# Altium project Dionysus.PrjPcb (part 2 of 2)

## Sheet FPGA Expansion.SchDoc: FPGA Expansion
size B; CompanyName: Cospan Design; DrawnBy: David McCoy; Engineer: David McCoy; DocumentNumber: 6; SheetNumber: 6; SheetTotal: 8
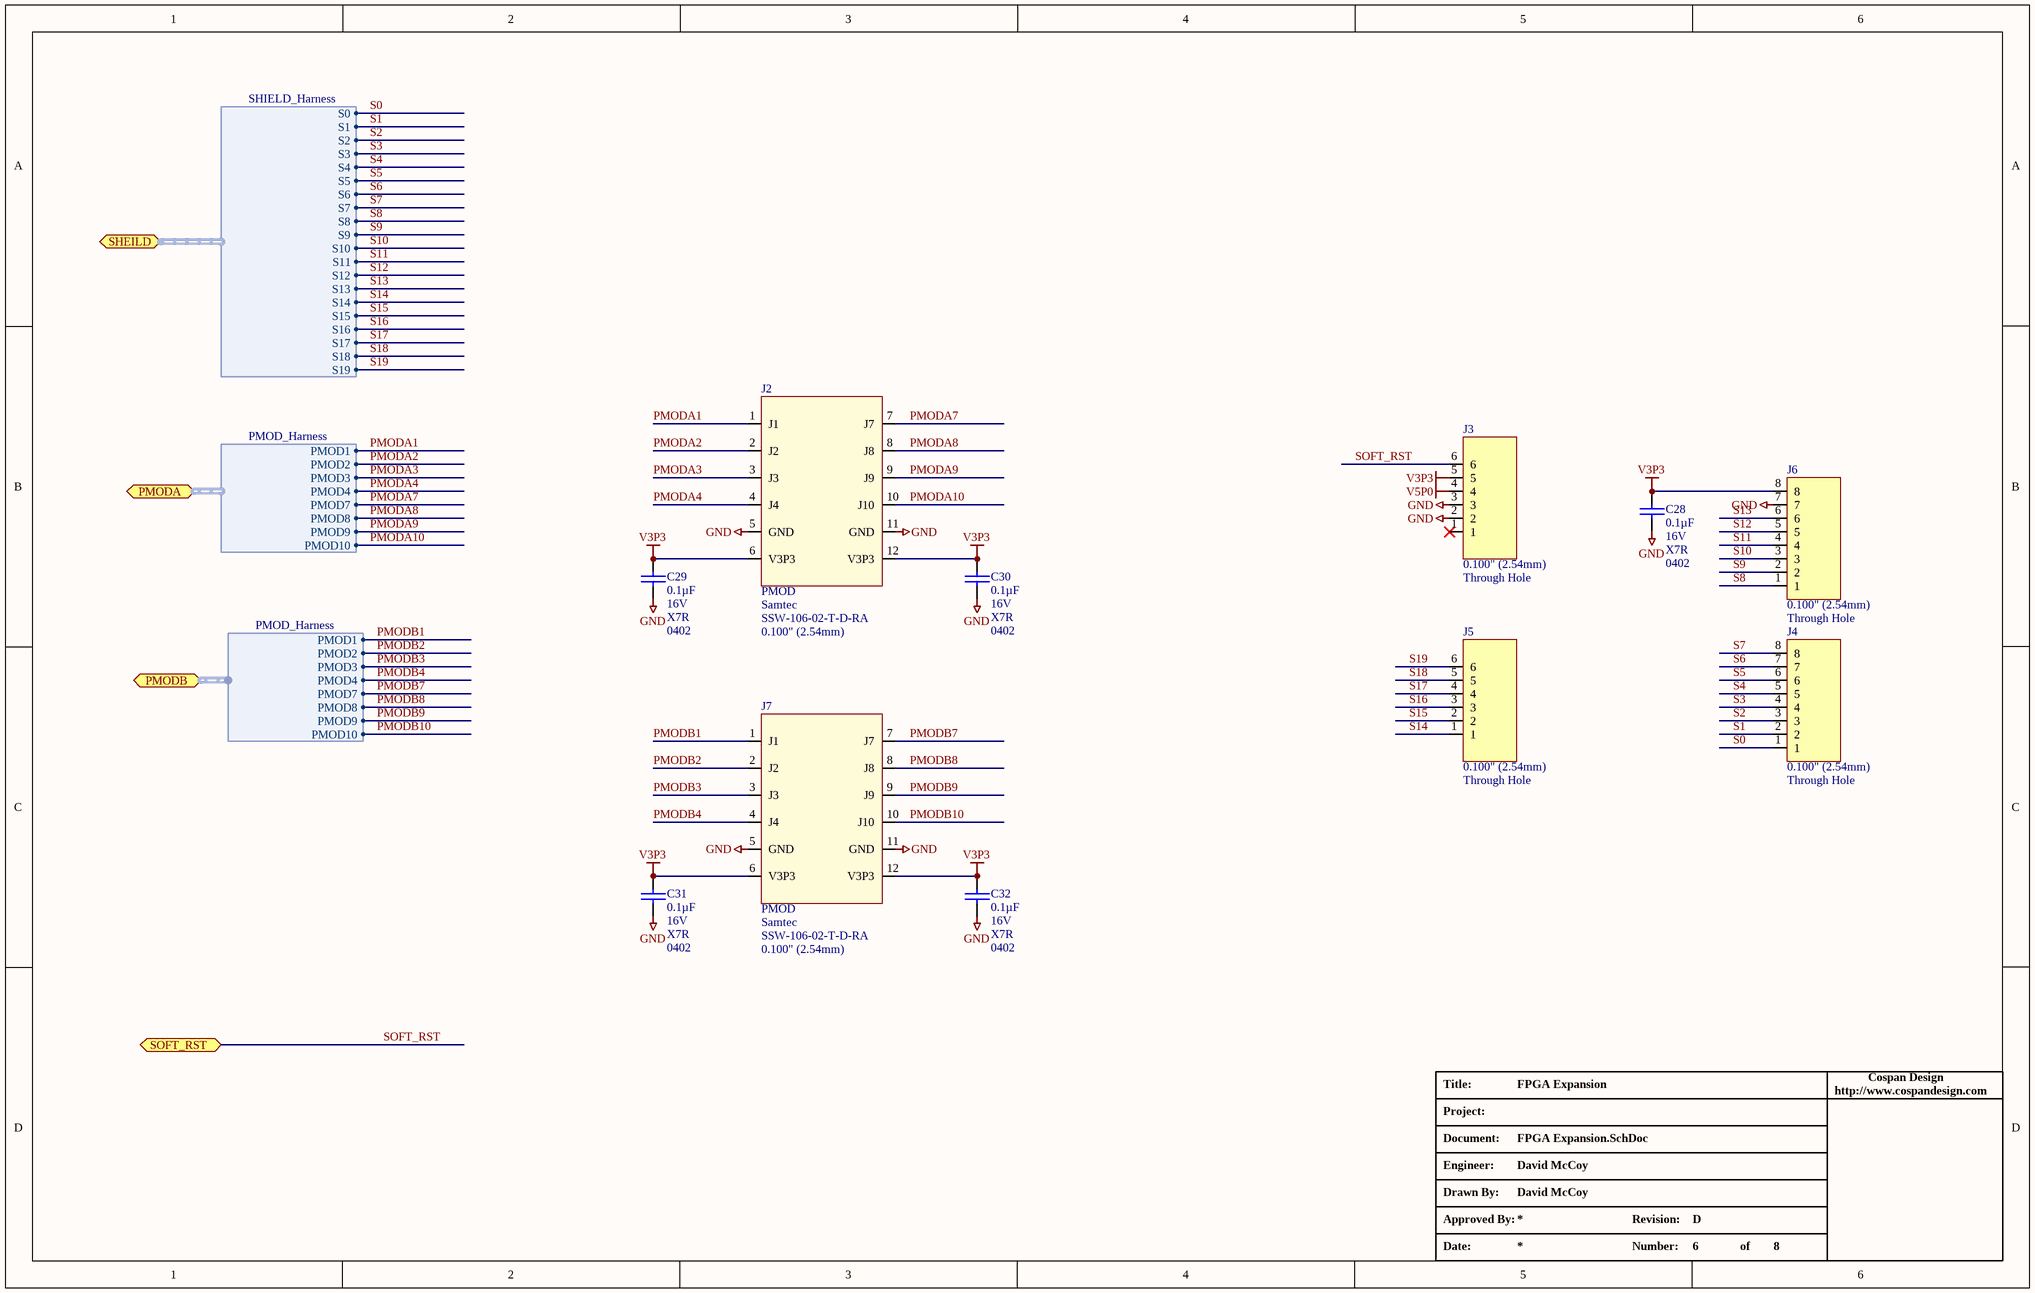
[diagram p4: FPGA Expansion.SchDoc]

### Parts
C28  Capacitance: 0.1µF  Voltage - Rated: 16V  Temperature Coefficient: X7R  Package / Case: 0402  [C_ERA-0402]  (hidden comment: 0.1uF)
C29  Capacitance: 0.1µF  Voltage - Rated: 16V  Temperature Coefficient: X7R  Package / Case: 0402  [C_ERA-0402]  (hidden comment: 0.1uF)
C30  Capacitance: 0.1µF  Voltage - Rated: 16V  Temperature Coefficient: X7R  Package / Case: 0402  [C_ERA-0402]  (hidden comment: 0.1uF)
C31  Capacitance: 0.1µF  Voltage - Rated: 16V  Temperature Coefficient: X7R  Package / Case: 0402  [C_ERA-0402]  (hidden comment: 0.1uF)
C32  Capacitance: 0.1µF  Voltage - Rated: 16V  Temperature Coefficient: X7R  Package / Case: 0402  [C_ERA-0402]  (hidden comment: 0.1uF)
J2  PMOD  Manufacturer: Samtec  Manufacturer Part Number: SSW-106-02-T-D-RA  Pitch: 0.100" (2.54mm)  [PMOD]
J3  Pitch: 0.100" (2.54mm)  Mounting Type: Through Hole  [HDR_1X6 - FEMALE]  (hidden comment: J_HDR1X6_THRHOLE_VERT_FEMALE)
J4  Pitch: 0.100" (2.54mm)  Mounting Type: Through Hole  [HDR_1X8 - FEMALE]  (hidden comment: J_HDR1X8_THRHOLE_VERT_RECPT)
J5  Pitch: 0.100" (2.54mm)  Mounting Type: Through Hole  [HDR_1X6 - FEMALE]  (hidden comment: J_HDR1X6_THRHOLE_VERT_FEMALE)
J6  Pitch: 0.100" (2.54mm)  Mounting Type: Through Hole  [HDR_1X8 - FEMALE]  (hidden comment: J_HDR1X8_THRHOLE_VERT_RECPT)
J7  PMOD  Manufacturer: Samtec  Manufacturer Part Number: SSW-106-02-T-D-RA  Pitch: 0.100" (2.54mm)  [PMOD]

### Ports
PMODA (harness PMOD_Harness), PMODB (harness PMOD_Harness), SHEILD (harness SHIELD_Harness), SOFT_RST

### Harnesses
SHIELD_Harness: S0, S1, S2, S3, S4, S5, S6, S7, S8, S9, S10, S11, S12, S13, S14, S15, S16, S17, S18, S19
PMOD_Harness: PMOD1, PMOD2, PMOD3, PMOD4, PMOD7, PMOD8, PMOD9, PMOD10

### Nets
GND: C28.1 C29.1 C30.1 C31.1 C32.1 J2.5(GND) J2.11(GND) J3.2 J3.3 J6.7 J7.5(GND) J7.11(GND)
V3P3: C28.2 C29.2 C30.2 C31.2 C32.2 J2.6(V3P3) J2.12(V3P3) J3.5 J6.8 J7.6(V3P3) J7.12(V3P3)  [project net ~{CS}]
V5P0: J3.4
PMODA1: J2.1(J1) ; port PMODA.PMOD1
PMODA2: J2.2(J2) ; port PMODA.PMOD2
PMODA3: J2.3(J3) ; port PMODA.PMOD3
PMODA4: J2.4(J4) ; port PMODA.PMOD4
PMODA7: J2.7(J7) ; port PMODA.PMOD7
PMODA8: J2.8(J8) ; port PMODA.PMOD8
PMODA9: J2.9(J9) ; port PMODA.PMOD9
PMODA10: J2.10(J10) ; port PMODA.PMOD10
PMODB1: J7.1(J1) ; port PMODB.PMOD1
PMODB2: J7.2(J2) ; port PMODB.PMOD2
PMODB3: J7.3(J3) ; port PMODB.PMOD3
PMODB4: J7.4(J4) ; port PMODB.PMOD4
PMODB7: J7.7(J7) ; port PMODB.PMOD7
PMODB8: J7.8(J8) ; port PMODB.PMOD8
PMODB9: J7.9(J9) ; port PMODB.PMOD9
PMODB10: J7.10(J10) ; port PMODB.PMOD10
S0: J4.1 ; port SHEILD.S0
S1: J4.2 ; port SHEILD.S1
S2: J4.3 ; port SHEILD.S2
S3: J4.4 ; port SHEILD.S3
S4: J4.5 ; port SHEILD.S4
S5: J4.6 ; port SHEILD.S5
S6: J4.7 ; port SHEILD.S6
S7: J4.8 ; port SHEILD.S7
S8: J6.1 ; port SHEILD.S8
S9: J6.2 ; port SHEILD.S9
S10: J6.3 ; port SHEILD.S10
S11: J6.4 ; port SHEILD.S11
S12: J6.5 ; port SHEILD.S12
S13: J6.6 ; port SHEILD.S13
S14: J5.1 ; port SHEILD.S14
S15: J5.2 ; port SHEILD.S15
S16: J5.3 ; port SHEILD.S16
S17: J5.4 ; port SHEILD.S17
S18: J5.5 ; port SHEILD.S18
S19: J5.6 ; port SHEILD.S19
SOFT_RST: J3.6 ; port SOFT_RST  [project net GPIOL2]

Not connected (* = marked no-connect by the designer): J3 1*

### Notes on the sheet
- Title:
- http://www.cospandesign.com
- Cospan Design
- Project:
- Document:
- Engineer:
- Drawn By:
- Approved By:
- Revision:
- Date:
- Number:
- of

### Library data of the parts
C28-C32 = C_0402_0.1UF_16V: CAP CER .10UF 16V X7R 0402; Manufacturer: TDK Corporation; Manufacturer Part Number: C1005X7R1C104K; Tolerance: ±10%; Supplier 1: Digi-Key; Supplier Part Number 1: 445-4952-1-ND; RoHS: RoHS Compliant; Category: Capacitors; Stock 1: 230800; Pricing: 10=0.024, 100=0.0143, 500=0.00826, 1000=0.00572 (USD); Mounting Type: Surface Mount, MLCC; Features: General Purpose; Lead Spacing: -; Thickness: 0.50mm; Packaging: Cut Tape (CT); ComponentLink1URL: http://www.tdk.co.jp/tefe02/e412_c.pdf; ComponentLink1Description: http://www.tdk.co.jp/tefe02/e412_c.pdf; Operating Temperature: -55°C ~ 125°C
J2 J7 = J_PMOD: CONN FEMALE 12POS DL .1" R/A TIN; Connector Type: Header; Number of Positions: 12; Number of Positions Loaded: All; Supplier 1: Samtec; Supplier Part Number 1: SSW-106-02-T-D-RA; Category: Connectors, Interconnects; Stock 1: 890; Contact Type: Female Socket; Number of Rows: 2; Row Spacing: 0.100" (2.54mm); Mounting Type: Through Hole, Right Angle; Termination: Solder; Fastening Type: -; Features: -; Contact Finish: Tin; Contact Finish Thickness: -; Color: Black; ComponentLink1URL: http://www.sullinscorp.com/drawings/101_xPxCxx2LJBN-RC,_10494-C.pdf; ComponentLink1Description: http://www.sullinscorp.com/drawings/101_xPxCxx2LJBN-RC,_10494-C.pdf; Pricing: 1=0.723
J3 J5 = J_HDR1X6_THRHOLE_VERT_FEMALE: CONN HEADER FEMALE 6POS .1" TIN; Manufacturer: Samtec; Manufacturer Part Number: SSW-106-01-T-S; Number of Positions: 6; Number of Positions Loaded: All; Supplier 1: Samtec; Supplier Part Number 1: SSW-106-01-T-S; Category: Connectors, Interconnects; Connector Type: Header; Contact Type: Female Socket; Number of Rows: 1; Termination: Solder; Contact Finish: Tin; Contact Finish Thickness: -; Color: Black; ComponentLink1URL: http://www.sullinscorp.com/drawings/101_xPxCxxxLFBN-RC,_10492-D.pdf; ComponentLink1Description: http://www.sullinscorp.com/drawings/101_xPxCxxxLFBN-RC,_10492-D.pdf; Pricing: 0.373
J4 J6 = J_HDR1X8_THRHOLE_VERT_FEMALE: CONN HEADER FEMALE 8POS .1" TIN; Manufacturer: Samtec; Manufacturer Part Number: SSW-108-01-T-S; Number of Positions: 8; Number of Positions Loaded: All; Supplier 1: Samtec; Supplier Part Number 1: SSW-108-01-T-S; RoHS: RoHS Compliant; Category: Connectors, Interconnects; Connector Type: Header; Contact Type: Female Socket; Number of Rows: 1; Termination: Solder; Fastening Type: -; Features: -; Contact Finish: Tin; Contact Finish Thickness: -; Color: Black; ComponentLink1URL: http://www.sullinscorp.com/drawings/101_xPxCxxxLFBN-RC,_10492-D.pdf; ComponentLink1Description: http://www.sullinscorp.com/drawings/101_xPxCxxxLFBN-RC,_10492-D.pdf; Pricing: 1=0.497

## Sheet FTDI.SchDoc: USB Communication
size B; CompanyName: Cospan Design; DrawnBy: David McCoy; Engineer: David McCoy; DocumentNumber: 8; SheetNumber: 8; SheetTotal: 8
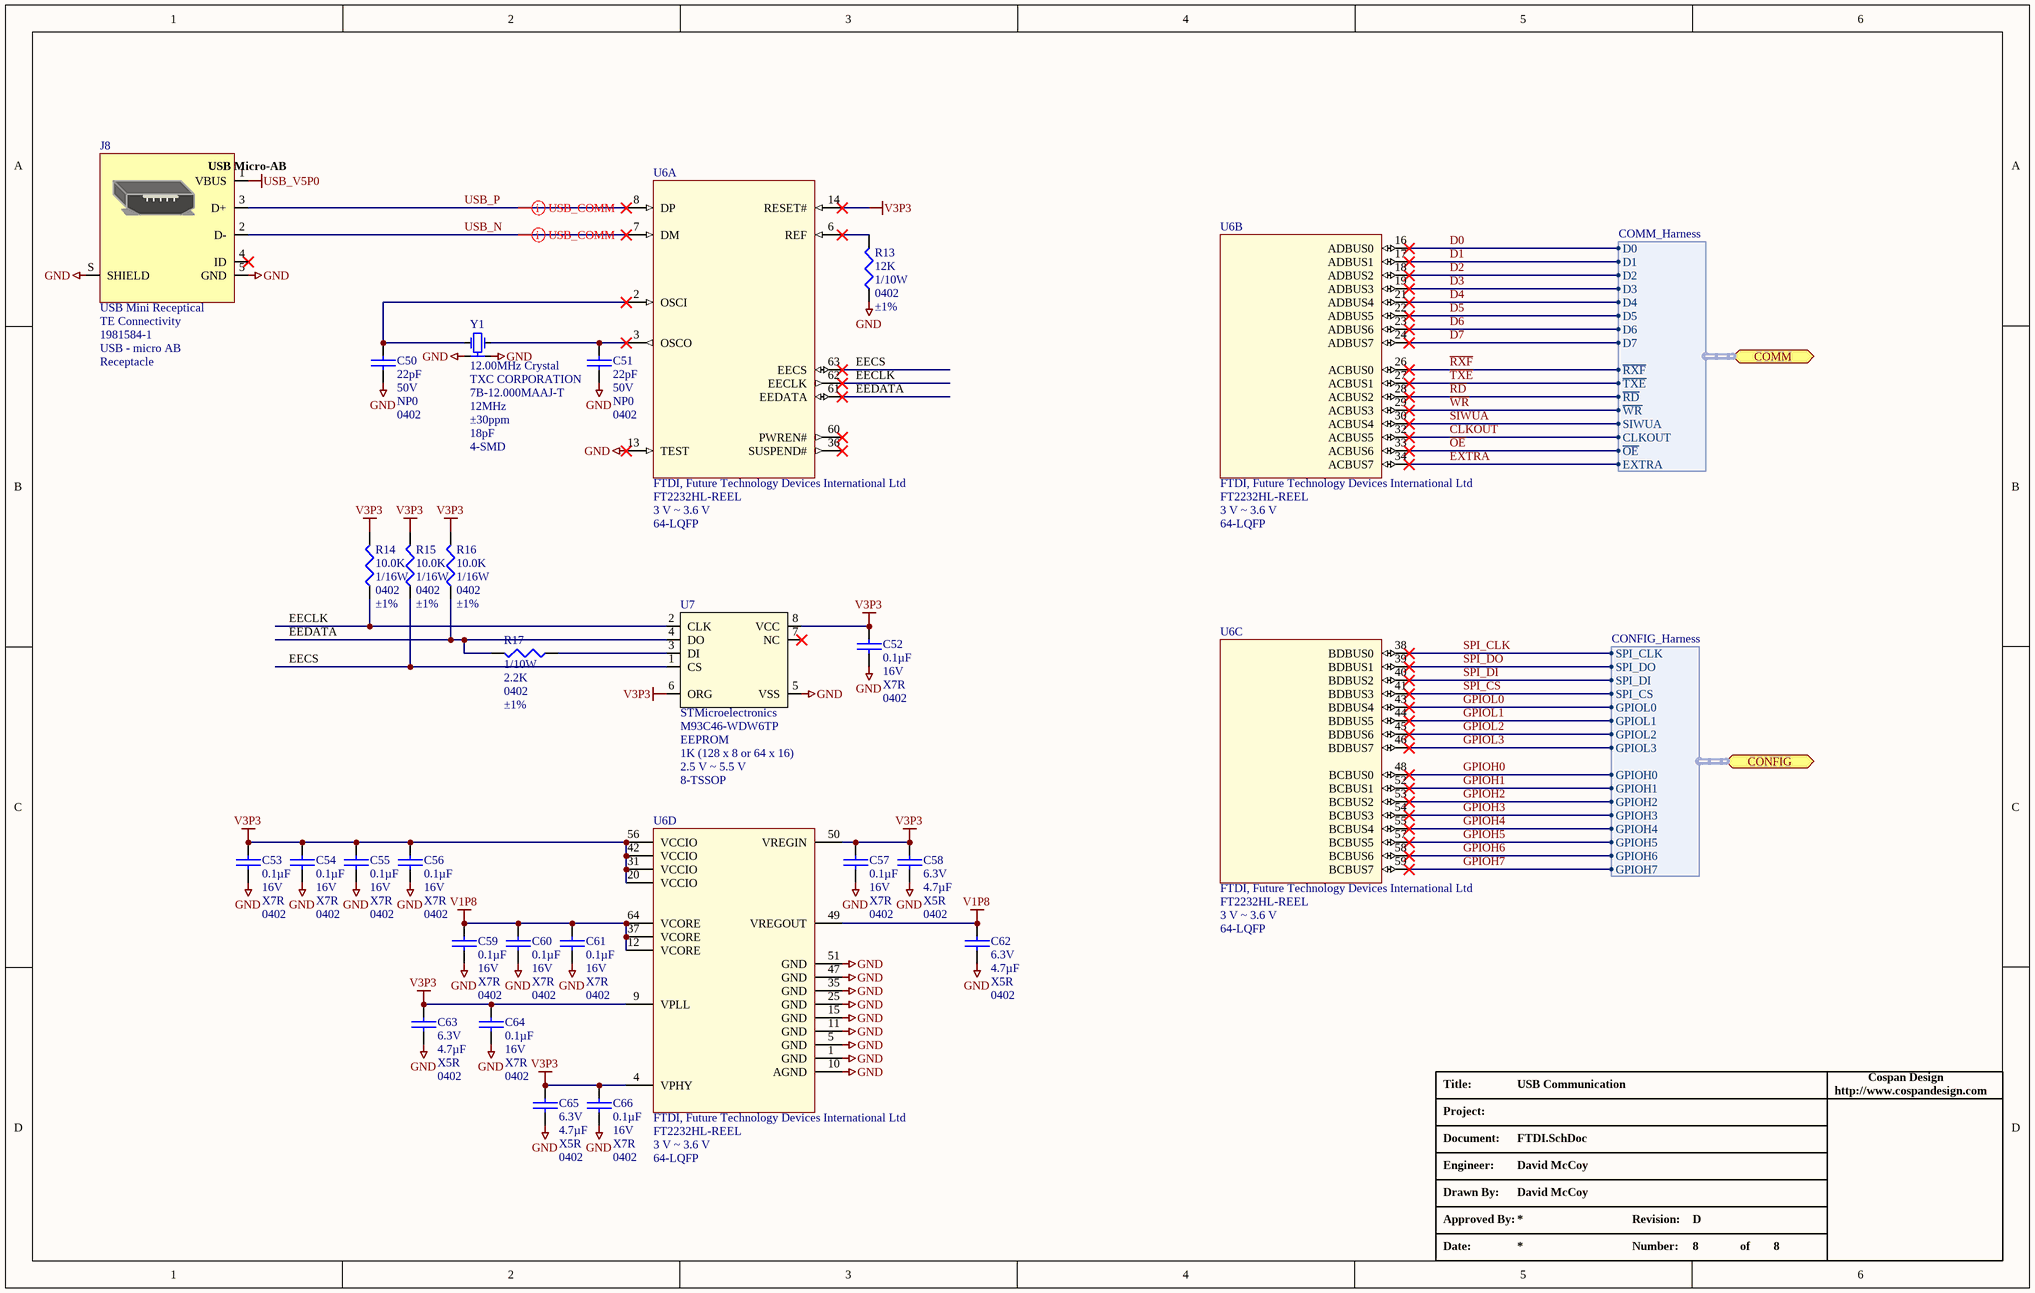
[diagram p5: FTDI.SchDoc]

### Parts
C50  Voltage - Rated: 50V  Temperature Coefficient: NP0  Package / Case: 0402  [C_ERA-0402]  (hidden comment: 22pF)
C51  Voltage - Rated: 50V  Temperature Coefficient: NP0  Package / Case: 0402  [C_ERA-0402]  (hidden comment: 22pF)
C52  Capacitance: 0.1µF  Voltage - Rated: 16V  Temperature Coefficient: X7R  Package / Case: 0402  [C_ERA-0402]  (hidden comment: 0.1uF)
C53  Capacitance: 0.1µF  Voltage - Rated: 16V  Temperature Coefficient: X7R  Package / Case: 0402  [C_ERA-0402]  (hidden comment: 0.1uF)
C54  Capacitance: 0.1µF  Voltage - Rated: 16V  Temperature Coefficient: X7R  Package / Case: 0402  [C_ERA-0402]  (hidden comment: 0.1uF)
C55  Capacitance: 0.1µF  Voltage - Rated: 16V  Temperature Coefficient: X7R  Package / Case: 0402  [C_ERA-0402]  (hidden comment: 0.1uF)
C56  Capacitance: 0.1µF  Voltage - Rated: 16V  Temperature Coefficient: X7R  Package / Case: 0402  [C_ERA-0402]  (hidden comment: 0.1uF)
C57  Capacitance: 0.1µF  Voltage - Rated: 16V  Temperature Coefficient: X7R  Package / Case: 0402  [C_ERA-0402]  (hidden comment: 0.1uF)
C58  Voltage - Rated: 6.3V  Capacitance: 4.7µF  Temperature Coefficient: X5R  Package / Case: 0402  [C_ERA-0402]  (hidden comment: 4.7uF)
C59  Capacitance: 0.1µF  Voltage - Rated: 16V  Temperature Coefficient: X7R  Package / Case: 0402  [C_ERA-0402]  (hidden comment: 0.1uF)
C60  Capacitance: 0.1µF  Voltage - Rated: 16V  Temperature Coefficient: X7R  Package / Case: 0402  [C_ERA-0402]  (hidden comment: 0.1uF)
C61  Capacitance: 0.1µF  Voltage - Rated: 16V  Temperature Coefficient: X7R  Package / Case: 0402  [C_ERA-0402]  (hidden comment: 0.1uF)
C62  Voltage - Rated: 6.3V  Capacitance: 4.7µF  Temperature Coefficient: X5R  Package / Case: 0402  [C_ERA-0402]  (hidden comment: 4.7uF)
C63  Voltage - Rated: 6.3V  Capacitance: 4.7µF  Temperature Coefficient: X5R  Package / Case: 0402  [C_ERA-0402]  (hidden comment: 4.7uF)
C64  Capacitance: 0.1µF  Voltage - Rated: 16V  Temperature Coefficient: X7R  Package / Case: 0402  [C_ERA-0402]  (hidden comment: 0.1uF)
C65  Voltage - Rated: 6.3V  Capacitance: 4.7µF  Temperature Coefficient: X5R  Package / Case: 0402  [C_ERA-0402]  (hidden comment: 4.7uF)
C66  Capacitance: 0.1µF  Voltage - Rated: 16V  Temperature Coefficient: X7R  Package / Case: 0402  [C_ERA-0402]  (hidden comment: 0.1uF)
J8  USB Mini Receptical  Manufacturer: TE Connectivity  Manufacturer Part Number: 1981584-1  Connector Type: USB - micro AB  Gender: Receptacle  [MICRO_USB_RECEPTICAL]
R13  Resistance (Ohms): 12K  Power (Watts): 1/10W  Case: 0402  Tolerance: ±1%  [ERA-0402]  (hidden comment: R_0402_12.0K)
R14  Resistance In Ohms: 10.0K  Power (Watts): 1/16W  Case: 0402  Tolerance: ±1%  [ERA-0402]  (hidden comment: R_0402_10.0K)
R15  Resistance In Ohms: 10.0K  Power (Watts): 1/16W  Case: 0402  Tolerance: ±1%  [ERA-0402]  (hidden comment: R_0402_10.0K)
R16  Resistance In Ohms: 10.0K  Power (Watts): 1/16W  Case: 0402  Tolerance: ±1%  [ERA-0402]  (hidden comment: R_0402_10.0K)
R17  Power (Watts): 1/10W  Resistance In Ohms: 2.2K  Case: 0402  Tolerance: ±1%  [ERA-0402]  (hidden comment: 2.2k Ohms)
U6  Manufacturer: FTDI, Future Technology Devices International Ltd  Manufacturer Part Number: FT2232HL-REEL  Voltage - Supply: 3 V ~ 3.6 V  Package / Case: 64-LQFP  [LQFP-64_N]  (hidden comment: U_FT2232H-LQFP64)  (parts A,B,C,D of 4)
U7  Manufacturer: STMicroelectronics  Manufacturer Part Number: M93C46-WDW6TP  Memory Size: 1K (128 x 8 or 64 x 16)  Voltage - Supply: 2.5 V ~ 5.5 V  Package / Case: 8-TSSOP  [TSOP65P640X120-8L]  (hidden comment: EEPROM)
Y1  12.00MHz Crystal  Manufacturer: TXC CORPORATION  Manufacturer Part Number: 7B-12.000MAAJ-T  Frequency: 12MHz  Frequency Tolerance: ±30ppm  Load Capacitance: 18pF  Package / Case: 4-SMD  [LCCS220P500X320X105-4L]

### Ports
COMM (harness COMM_Harness), CONFIG (harness CONFIG_Harness)

### Harnesses
COMM_Harness: D0, D1, D2, D3, D4, D5, D6, D7, ~{RXF}, ~{TXE}, ~{RD}, ~{WR}, SIWUA, CLKOUT, ~{OE}, EXTRA
CONFIG_Harness: SPI_CLK, SPI_DO, SPI_DI, SPI_CS, GPIOL0, GPIOL1, GPIOL2, GPIOL3, GPIOH0, GPIOH1, GPIOH2, GPIOH3, GPIOH4, GPIOH5, GPIOH6, GPIOH7

### Nets
GND: C50.1 C51.1 C52.1 C53.1 C54.1 C55.1 C56.1 C57.1 C58.1 C59.1 C60.1 C61.1 C62.1 C63.1 C64.1 C65.1 C66.1 J8.5(GND) J8.S(SHIELD) R13.2 U6.1(GND) U6.5(GND) U6.10(AGND) U6.11(GND) U6.13(TEST) U6.15(GND) U6.25(GND) U6.35(GND) U6.47(GND) U6.51(GND) U7.5(VSS) Y1.2 Y1.4
USB_V5P0: J8.1(VBUS)
V1P8: C59.2 C60.2 C61.2 C62.2 U6.12(VCORE) U6.37(VCORE) U6.49(VREGOUT) U6.64(VCORE)
V3P3: C52.2 C53.2 C54.2 C55.2 C56.2 C57.2 C58.2 C63.2 C64.2 C65.2 C66.2 R14.1 R15.1 R16.1 U6.4(VPHY) U6.9(VPLL) U6.14(RESET#) U6.20(VCCIO) U6.31(VCCIO) U6.42(VCCIO) U6.50(VREGIN) U6.56(VCCIO) U7.6(ORG) U7.8(VCC)  [project net ~{CS}]
CLKOUT: U6.32(ACBUS5) ; port COMM.CLKOUT
D0: U6.16(ADBUS0) ; port COMM.D0
D1: U6.17(ADBUS1) ; port COMM.D1
D2: U6.18(ADBUS2) ; port COMM.D2
D3: U6.19(ADBUS3) ; port COMM.D3
D4: U6.21(ADBUS4) ; port COMM.D4
D5: U6.22(ADBUS5) ; port COMM.D5
D6: U6.23(ADBUS6) ; port COMM.D6
D7: U6.24(ADBUS7) ; port COMM.D7
EECLK: R14.2 U6.62(EECLK) U7.2(CLK)
EECS: R15.2 U6.63(EECS) U7.1(CS)
EEDATA: R16.2 R17.1 U6.61(EEDATA) U7.4(DO)
EXTRA: U6.34(ACBUS7) ; port COMM.EXTRA
GPIOH0: U6.48(BCBUS0) ; port CONFIG.GPIOH0
GPIOH1: U6.52(BCBUS1) ; port CONFIG.GPIOH1
GPIOH2: U6.53(BCBUS2) ; port CONFIG.GPIOH2
GPIOH3: U6.54(BCBUS3) ; port CONFIG.GPIOH3
GPIOH4: U6.55(BCBUS4) ; port CONFIG.GPIOH4
GPIOH5: U6.57(BCBUS5) ; port CONFIG.GPIOH5
GPIOH6: U6.58(BCBUS6) ; port CONFIG.GPIOH6
GPIOH7: U6.59(BCBUS7) ; port CONFIG.GPIOH7
GPIOL0: U6.43(BDBUS4) ; port CONFIG.GPIOL0  [project net FPGA_PROGRAM]
GPIOL1: U6.44(BDBUS5) ; port CONFIG.GPIOL1
GPIOL2: U6.45(BDBUS6) ; port CONFIG.GPIOL2
GPIOL3: U6.46(BDBUS7) ; port CONFIG.GPIOL3
~{OE}: U6.33(ACBUS6) ; port COMM.~{OE}
~{RD}: U6.28(ACBUS2) ; port COMM.~{RD}
~{RXF}: U6.26(ACBUS0) ; port COMM.~{RXF}
SIWUA: U6.30(ACBUS4) ; port COMM.SIWUA
SPI_CLK: U6.38(BDBUS0) ; port CONFIG.SPI_CLK
SPI_CS: U6.41(BDBUS3) ; port CONFIG.SPI_CS
SPI_DI: U6.40(BDBUS2) ; port CONFIG.SPI_DI
SPI_DO: U6.39(BDBUS1) ; port CONFIG.SPI_DO
~{TXE}: U6.27(ACBUS1) ; port COMM.~{TXE}
USB_N: J8.2(D-) U6.7(DM)
USB_P: J8.3(D+) U6.8(DP)
~{WR}: U6.29(ACBUS3) ; port COMM.~{WR}
NetC50_2: C50.2 U6.2(OSCI) Y1.1
NetC51_2: C51.2 U6.3(OSCO) Y1.3
NetR13_1: R13.1 U6.6(REF)
NetR17_2: R17.2 U7.3(DI)

Not connected (* = marked no-connect by the designer): J8 4(ID)*; U6 36(SUSPEND#)* 60(PWREN#)*; U7 7(NC)*

### Layout directives
differential pair: USB_N, USB_P

### Notes on the sheet
- Title:
- http://www.cospandesign.com
- Cospan Design
- Project:
- Document:
- Engineer:
- Drawn By:
- Approved By:
- Revision:
- Date:
- Number:
- of
- (in symbol J_USB_MICRO_AB) USB Micro-AB

### Library data of the parts
C50 C51 = C_0402_22PF_50V: CAP CER 22PF 50V NP0 0402; Manufacturer: TDK Corporation; Manufacturer Part Number: C1005C0G1H220F; Tolerance: ±1%; Supplier 1: Digi-Key; Supplier Part Number 1: 445-5360-1-ND; RoHS: RoHS Compliant; Category: Capacitors; Stock 1: 16726; Pricing: 1=0.44, 10=0.385, 100=0.1925, 250=0.154, 500=0.14026, 1000=0.1265, 5000=0.1045 (USD); Mounting Type: Surface Mount, MLCC; Operating Temperature: -55°C ~ 125°C; Features: -; Applications: General Purpose; Ratings: -; Size / Dimension: 0.039" L x 0.020" W (1.00mm x 0.50mm); Lead Spacing: -; Packaging: Cut Tape (CT); Lead Style: -; ComponentLink1URL: http://www.tdk.com/pdf/tight_tol_B11.pdf; ComponentLink1Description: http://www.tdk.com/pdf/tight_tol_B11.pdf; Capacitance: 22pF; Height - Seated (Max): -; Thickness (Max): 0.022" (0.55mm)
C52-C57 C59-C61 C64 C66 = C_0402_0.1UF_16V: as C28 on sheet FPGA Expansion; Supplier 1: Digi-Key; Supplier Part Number 1: 445-4952-1-ND; RoHS: RoHS Compliant; Category: Capacitors; Stock 1: 230800; Pricing: 10=0.024, 100=0.0143, 500=0.00826, 1000=0.00572 (USD); Mounting Type: Surface Mount, MLCC; Features: General Purpose; Lead Spacing: -; Thickness: 0.50mm; Packaging: Cut Tape (CT); ComponentLink1URL: http://www.tdk.co.jp/tefe02/e412_c.pdf; ComponentLink1Description: http://www.tdk.co.jp/tefe02/e412_c.pdf; Operating Temperature: -55°C ~ 125°C
C58 C62 C63 C65 = C_0402_4.7UF: CAP CER 4.7UF 6.3V X5R 0402; Manufacturer: Murata Electronics North America; Manufacturer Part Number: GRM155R60J475ME87D; Tolerance: ±20%; Supplier 1: Digi-Key; Supplier Part Number 1: 445-7395-1-ND; RoHS: RoHS Compliant; Category: Capacitors; Stock 1: 1176918; Pricing: 1=0.46, 10=0.365, 50=0.264, 100=0.22, 250=0.165, 500=0.1408, 1000=0.11, 5000=0.0836 (USD); Mounting Type: Surface Mount, MLCC; Operating Temperature: -55°C ~ 85°C; Applications: General Purpose; Ratings: -; Size / Dimension: 0.039" L x 0.020" W (1.00mm x 0.50mm); Height: -; Thickness: 0.022" (0.55mm); Lead Spacing: -; Features: -; Packaging: Cut Tape (CT); Lead Style: -; ComponentLink1URL: http://www.murata.com/products/catalog/pdf/c02e.pdf; ComponentLink1Description: http://www.murata.com/products/catalog/pdf/c02e.pdf; Stock 2: 8098; Pricing 2: 1=0.32, 10=0.28, 100=0.14, 250=0.112, 500=0.102, 1000=0.092, 5000=0.076 (USD); Height - Seated (Max): -; Thickness (Max): 0.026" (0.65mm); ComponentLink2URL: http://www.tdk.com/pdf/general_B11.pdf; ComponentLink2Description: http://www.tdk.com/pdf/general_B11.pdf
J8 = J_USB_MICRO_AB: CONN RCPT MICRO USB TYPE AB; Number of Contacts: 5; Specifications: USB 1.0; Supplier 1: Digi-Key; Supplier Part Number 1: A97799CT-ND; RoHS: RoHS Compliant; Category: Connectors, Interconnects; Stock 1: 8650; Pricing: 1=1.23, 10=1.082, 25=1.0184, 50=0.9758, 100=0.9334, 250=0.84856, 500=0.76368 (USD); Mounting Type: Surface Mount, Right Angle, Horizontal; Features: -; Packaging: Cut Tape (CT); Ingress Protection: -; ComponentLink1URL: http://documents.tycoelectronics.com/commerce/DocumentDelivery/DDEController?Action=srchrtrv&DocNm=1981584&DocType=CD&DocLang=EN; ComponentLink1Description: http://documents.tycoelectronics.com/commerce/DocumentDelivery/DDEController?Action=srchrtrv&DocNm=1981584&DocType=CD&DocLang=EN
R13 = R_0402_12.0K: RES 12.0K OHM 1/16W 1% 0402 SMD; Manufacturer: Panasonic - ECG; Manufacturer Part Number: ERJ-2RKF1202X; Temperature Coefficient: ±100ppm/°C; Supplier 1: Digi-Key; Supplier Part Number 1: P12.0KLDKR-ND; RoHS: RoHS Compliant; Category: Resistors; Stock 1: 282752; Pricing: 1=0.06, 50=0.0242, 100=0.0184, 250=0.01364, 500=0.01008, 1000=0.00672, 5000=0.00473 (USD); Composition: Thick Film; Features: -; Size / Dimension: 0.039" L x 0.020" W (1.00mm x 0.50mm); Height: 0.014" (0.35mm); Number of Terminations: 2; Packaging: Digi-Reel®; Package / Case: 0402 (1005 Metric); ComponentLink1URL: http://industrial.panasonic.com/www-cgi/jvcr13pz.cgi?E+PZ+3+AOA0002+ERJ2RKF1202X+7+WW; ComponentLink1Description: http://industrial.panasonic.com/www-cgi/jvcr13pz.cgi?E+PZ+3+AOA0002+ERJ2RKF1202X+7+WW
R14-R16 = R_0402_10.0K: RES 10.0K OHM 1/16W 1% 0402 SMD; Manufacturer: Stackpole Electronics Inc; Manufacturer Part Number: RMCF0402FT10K0; Temperature Coefficient: ±100ppm/°C; Resistance (Ohms): 10k; Supplier 1: Digi-Key; Supplier Part Number 1: RMCF0402FT10K0CT-ND; RoHS: RoHS Compliant; Category: Resistors; Stock 1: 234525; Pricing: 1=0.04, 10=0.025, 50=0.0138, 100=0.0105, 250=0.0078, 500=0.00576, 1000=0.00384, 2500=0.00324, 5000=0.0027 (USD); Composition: Thick Film; Features: -; Packaging: Cut Tape (CT); ComponentLink1URL: http://www.seielect.com/Catalog/SEI-RMCF_RMCP.pdf; ComponentLink1Description: http://www.seielect.com/Catalog/SEI-RMCF_RMCP.pdf; Package / Case: 0402 (1005 Metric); Size / Dimension: 0.039" L x 0.020" W (1.00mm x 0.50mm); Height: 0.016" (0.40mm); Number of Terminations: 2
R17 = R_0402_2.2K: RES 2.20K OHM 1/10W 1% 0402 SMD; Manufacturer: Yageo; Manufacturer Part Number: RC0402FR-072K2L; Temperature Coefficient: ±100ppm/°C; Supplier 1: Digi-Key; Supplier Part Number 1: 311-2.20KLRCT-ND; RoHS: RoHS Compliant; Category: Resistors; Stock 1: 0; Pricing: 10=0.014, 100=0.0063, 500=0.00382, 1000=0.0027, 5000=0.00203 (USD); Resistance (Ohms): 2.2K; Composition: Thick Film; Features: -; Size / Dimension: 0.039" L x 0.020" W (1.00mm x 0.50mm); Height: 0.016" (0.40mm); Packaging: Cut Tape (CT); Package / Case: 0402 (1005 Metric); ComponentLink1URL: http://www.yageo.com/documents/recent/PYu-RC0402_51_RoHS_L_6.pdf; ComponentLink1Description: http://www.yageo.com/documents/recent/PYu-RC0402_51_RoHS_L_6.pdf; Number of Terminations: 2
U6 = U_FT2232H-LQFP64: IC USB HS DUAL UART/FIFO 64-LQFP; Number of Channels: 2, DUART; FIFO's: 4096 Byte; Protocol: RS-232, RS-422, RS-485; With Parallel Port: Yes; Supplier 1: Digi-Key; RoHS: RoHS Compliant; Category: Integrated Circuits (ICs); Stock 1: 18803; Pricing 1: 1=6.71, 10=6.2, 50=5.77, 100=5.4, 250=4.56, 500=4.06 (USD); Features: USB to UART and/or FIFO, SPI, I2C, JTAG; With Auto Flow Control: Yes; With IrDA Encoder/Decoder: -; With False Start Bit Detection: -; With Modem Control: Yes; With CMOS: Yes; Mounting Type: Surface Mount; Supplier Device Package: 64-LQFP; Packaging: Cut Tape (CT); ComponentLink1URL: http://www.ftdichip.com/Support/Documents/DataSheets/ICs/DS_FT2232H.pdf; ComponentLink1Description: http://www.ftdichip.com/Support/Documents/DataSheets/ICs/DS_FT2232H.pdf; Supplier Part Number 1: 768-1024-1-ND
U7 = U_EEPROM_M93C46-WDW6TP: IC EEPROM 1KBIT 2MHZ 8TSSO; Format - Memory: EEPROMs - Serial; Interface: Microwire, 3-Wire Serial; Supplier 1: Digi-Key; RoHS: RoHS Compliant; Category: Integrated Circuits (ICs); Stock 1: 16982; Pricing 1: 1=0.64, 10=0.51, 100=0.3828, 250=0.3306, 500=0.2842, 1000=0.2204 (USD); Speed: 2MHz; Operating Temperature: -40°C ~ 85°C; Supplier Device Package: 8-TSSOP; Packaging: Cut Tape (CT); ComponentLink1URL: http://www.st.com/internet/com/TECHNICAL_RESOURCES/TECHNICAL_LITERATURE/DATASHEET/CD00001142.pdf; ComponentLink1Description: http://www.st.com/internet/com/TECHNICAL_RESOURCES/TECHNICAL_LITERATURE/DATASHEET/CD00001142.pdf; Supplier Part Number 1: 497-8655-1-ND; Memory Type: EEPROM
Y1 = Y_SMD_12.00MHZ_18PF: CRYSTAL 12.000 MHZ 18PF SMD; Operating Mode: Fundamental; Supplier 1: Digi-Key; RoHS: RoHS Compliant; Category: Crystals and Oscillators; Stock 1: 13709; Pricing 1: 1=1.13, 10=0.975, 50=0.855, 100=0.675, 500=0.57 (USD); Type: MHz Crystal; Frequency Stability: ±30ppm; Operating Temperature: -20°C ~ 70°C; Mounting Type: Surface Mount; Size / Dimension: 0.197" L x 0.126" W (5.00mm x 3.20mm); Height: 0.041" (1.05mm); Packaging: Cut Tape (CT); ComponentLink1URL: http://www.txccrystal.com/images/pdf/7b.pdf; ComponentLink1Description: http://www.txccrystal.com/images/pdf/7b.pdf; Supplier Part Number 1: 887-1099-1-ND

## Sheet SPI Flash.SchDoc: SPI Flash
size B; CompanyName: Cospan Design; DrawnBy: David McCoy; Engineer: David McCoy; DocumentNumber: 3; SheetNumber: 3; SheetTotal: 8
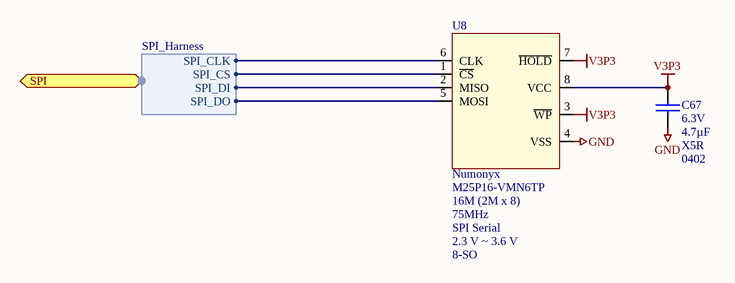
[diagram p6: SPI Flash.SchDoc]

### Parts
C67  Voltage - Rated: 6.3V  Capacitance: 4.7µF  Temperature Coefficient: X5R  Package / Case: 0402  [C_ERA-0402]  (hidden comment: 4.7uF)
U8  Manufacturer: Numonyx  Manufacturer Part Number: M25P16-VMN6TP  Memory Size: 16M (2M x 8)  Speed: 75MHz  Interface: SPI Serial  Voltage - Supply: 2.3 V ~ 3.6 V  Supplier Device Package: 8-SO  [SOIC127P600X135-8L]  (hidden comment: U_16MBIT_SPI_FLASH)

### Ports
SPI (harness SPI_Harness)

### Harnesses
SPI_Harness: SPI_CLK, SPI_DO, SPI_DI, SPI_CS

### Nets
GND: C67.1 U8.4(VSS)
V3P3: C67.2 U8.3(~{WP}) U8.7(~{HOLD}) U8.8(VCC)  [project net ~{CS}]
SPI_CLK: U8.6(CLK) ; port SPI.SPI_CLK
SPI_CS: U8.1(~{CS}) ; port SPI.SPI_CS
SPI_DI: U8.2(MISO) ; port SPI.SPI_DI
SPI_DO: U8.5(MOSI) ; port SPI.SPI_DO

### Notes on the sheet
- Title:
- http://www.cospandesign.com
- Cospan Design
- Project:
- Document:
- Engineer:
- Drawn By:
- Approved By:
- Revision:
- Date:
- Number:
- of

### Library data of the parts
C67 = C_0402_4.7UF: as C58 on sheet FTDI; Supplier 1: Digi-Key; Supplier Part Number 1: 445-7395-1-ND; RoHS: RoHS Compliant; Category: Capacitors; Stock 1: 1176918; Pricing: 1=0.46, 10=0.365, 50=0.264, 100=0.22, 250=0.165, 500=0.1408, 1000=0.11, 5000=0.0836 (USD); Mounting Type: Surface Mount, MLCC; Operating Temperature: -55°C ~ 85°C; Applications: General Purpose; Ratings: -; Size / Dimension: 0.039" L x 0.020" W (1.00mm x 0.50mm); Height: -; Thickness: 0.022" (0.55mm); Lead Spacing: -; Features: -; Packaging: Cut Tape (CT); Lead Style: -; ComponentLink1URL: http://www.murata.com/products/catalog/pdf/c02e.pdf; ComponentLink1Description: http://www.murata.com/products/catalog/pdf/c02e.pdf; Stock 2: 8098; Pricing 2: 1=0.32, 10=0.28, 100=0.14, 250=0.112, 500=0.102, 1000=0.092, 5000=0.076 (USD); Height - Seated (Max): -; Thickness (Max): 0.026" (0.65mm); ComponentLink2URL: http://www.tdk.com/pdf/general_B11.pdf; ComponentLink2Description: http://www.tdk.com/pdf/general_B11.pdf
U8 = U_16MBIT_SPI_FLASH: IC FLASH 16MBIT 75MHZ 8SOIC; Memory Type: FLASH - Nor; Supplier 1: Digi-Key; Supplier Part Number 1: M25P16-VMN6TPCT-ND; RoHS: RoHS Compliant; Category: Integrated Circuits (ICs); Stock 1: 0; Pricing: 1=1.17, 10=1.062, 25=1.0488, 50=1.0428, 100=0.9322, 250=0.92436, 500=0.91066, 1000=0.87785 (USD); Format - Memory: FLASH; Operating Temperature: -40°C ~ 85°C; Package / Case: 8-SOIC (0.154", 3.90mm Width); Packaging: Cut Tape (CT); ComponentLink1URL: http://media.digikey.com/pdf/Data%20Sheets/Numonyx,Intel/M25P16.pdf; ComponentLink1Description: http://media.digikey.com/pdf/Data%20Sheets/Numonyx,Intel/M25P16.pdf

## Nets that join several sheets
~{CS}: FPGA (51 pins), Power (9 pins), SDRAM (17 pins), FPGA Expansion (11 pins), FTDI (24 pins), SPI Flash (C67.2 U8.3 U8.7 U8.8)
GND: FPGA (53 pins), Power (16 pins), SDRAM (16 pins), FPGA Expansion (12 pins), FTDI (33 pins), SPI Flash (C67.1 U8.4)
USB_V5P0: Power (J10.3), FTDI (J8.1)
V1P2: FPGA (9 pins), Power (C38.2 L2.2 R19.1 U4.5)
V5P0: Power (5 pins), FPGA Expansion (J3.4)
A0: FPGA (U1.35), SDRAM (U5.23)
A1: FPGA (U1.23), SDRAM (U5.24)
A2: FPGA (U1.22), SDRAM (U5.25)
A3: FPGA (U1.21), SDRAM (U5.26)
A4: FPGA (U1.14), SDRAM (U5.29)
A5: FPGA (U1.15), SDRAM (U5.30)
A6: FPGA (U1.26), SDRAM (U5.31)
A7: FPGA (U1.27), SDRAM (U5.32)
A8: FPGA (U1.29), SDRAM (U5.33)
A9: FPGA (U1.33), SDRAM (U5.34)
A10: FPGA (U1.24), SDRAM (U5.22)
A11: FPGA (U1.30), SDRAM (U5.35)
BA0: FPGA (U1.32), SDRAM (U5.20)
BA1: FPGA (U1.34), SDRAM (U5.21)
~{CAS}: FPGA (U1.45), SDRAM (U5.17)
CKE: FPGA (U1.40), SDRAM (U5.37)
CLK: FPGA (U1.57), SDRAM (R11.2)
CLKOUT: FPGA (U1.123), FTDI (U6.32)
D0: FPGA (U1.133), FTDI (U6.16)
D1: FPGA (U1.132), FTDI (U6.17)
D2: FPGA (U1.131), FTDI (U6.18)
D3: FPGA (U1.127), FTDI (U6.19)
D4: FPGA (U1.119), FTDI (U6.21)
D5: FPGA (U1.116), FTDI (U6.22)
D6: FPGA (U1.118), FTDI (U6.23)
D7: FPGA (U1.115), FTDI (U6.24)
DQ0: FPGA (U1.62), SDRAM (U5.2)
DQ1: FPGA (U1.61), SDRAM (U5.4)
DQ2: FPGA (U1.59), SDRAM (U5.5)
DQ3: FPGA (U1.58), SDRAM (U5.7)
DQ4: FPGA (U1.56), SDRAM (U5.8)
DQ5: FPGA (U1.47), SDRAM (U5.10)
DQ6: FPGA (U1.139), SDRAM (U5.11)
DQ7: FPGA (U1.55), SDRAM (U5.13)
DQ8: FPGA (U1.50), SDRAM (U5.42)
DQ9: FPGA (U1.48), SDRAM (U5.44)
DQ10: FPGA (U1.75), SDRAM (U5.45)
DQ11: FPGA (U1.16), SDRAM (U5.47)
DQ12: FPGA (U1.17), SDRAM (U5.48)
DQ13: FPGA (U1.74), SDRAM (U5.50)
DQ14: FPGA (U1.66), SDRAM (U5.51)
DQ15: FPGA (U1.67), SDRAM (U5.53)
DQMH: FPGA (U1.41), SDRAM (U5.39)
DQML: FPGA (U1.43), SDRAM (U5.15)
FPGA_PROGRAM: FPGA (C74.2 R9.2 S3.1 U1.37), FTDI (U6.43)
GPIOL2: FPGA (C75.2 R26.2 S4.1 U1.111), FPGA Expansion (J3.6), FTDI (U6.45)
~{OE}: FPGA (U1.114), FTDI (U6.33)
PMODA1: FPGA (U1.9), FPGA Expansion (J2.1)
PMODA2: FPGA (U1.12), FPGA Expansion (J2.2)
PMODA3: FPGA (U1.8), FPGA Expansion (J2.3)
PMODA4: FPGA (U1.6), FPGA Expansion (J2.4)
PMODA7: FPGA (U1.10), FPGA Expansion (J2.7)
PMODA8: FPGA (U1.11), FPGA Expansion (J2.8)
PMODA9: FPGA (U1.7), FPGA Expansion (J2.9)
PMODA10: FPGA (U1.1), FPGA Expansion (J2.10)
PMODB1: FPGA (U1.85), FPGA Expansion (J7.1)
PMODB2: FPGA (U1.83), FPGA Expansion (J7.2)
PMODB3: FPGA (U1.81), FPGA Expansion (J7.3)
PMODB4: FPGA (U1.78), FPGA Expansion (J7.4)
PMODB7: FPGA (U1.84), FPGA Expansion (J7.7)
PMODB8: FPGA (U1.82), FPGA Expansion (J7.8)
PMODB9: FPGA (U1.79), FPGA Expansion (J7.9)
PMODB10: FPGA (U1.80), FPGA Expansion (J7.10)
~{RAS}: FPGA (U1.44), SDRAM (U5.18)
~{RD}: FPGA (U1.124), FTDI (U6.28)
~{RXF}: FPGA (U1.117), FTDI (U6.26)
S0: FPGA (U1.87), FPGA Expansion (J4.1)
S1: FPGA (U1.88), FPGA Expansion (J4.2)
S2: FPGA (U1.92), FPGA Expansion (J4.3)
S3: FPGA (U1.93), FPGA Expansion (J4.4)
S4: FPGA (U1.94), FPGA Expansion (J4.5)
S5: FPGA (U1.95), FPGA Expansion (J4.6)
S6: FPGA (U1.97), FPGA Expansion (J4.7)
S7: FPGA (U1.98), FPGA Expansion (J4.8)
S8: FPGA (U1.99), FPGA Expansion (J6.1)
S9: FPGA (U1.100), FPGA Expansion (J6.2)
S10: FPGA (U1.101), FPGA Expansion (J6.3)
S11: FPGA (U1.102), FPGA Expansion (J6.4)
S12: FPGA (U1.104), FPGA Expansion (J6.5)
S13: FPGA (U1.105), FPGA Expansion (J6.6)
S14: FPGA (U1.2), FPGA Expansion (J5.1)
S15: FPGA (U1.5), FPGA Expansion (J5.2)
S16: FPGA (U1.143), FPGA Expansion (J5.3)
S17: FPGA (U1.142), FPGA Expansion (J5.4)
S18: FPGA (U1.141), FPGA Expansion (J5.5)
S19: FPGA (U1.140), FPGA Expansion (J5.6)
SIWUA: FPGA (U1.120), FTDI (U6.30)
SPI_CLK: FPGA (U1.70), FTDI (U6.38), SPI Flash (U8.6)
SPI_CS: FPGA (U1.38), FTDI (U6.41), SPI Flash (U8.1)
SPI_DI: FPGA (U1.65), FTDI (U6.40), SPI Flash (U8.2)
SPI_DO: FPGA (U1.64), FTDI (U6.39), SPI Flash (U8.5)
~{TXE}: FPGA (U1.126), FTDI (U6.27)
~{WE}: FPGA (U1.46), SDRAM (U5.16)
~{WR}: FPGA (U1.121), FTDI (U6.29)